# Altium schematic sheet Motor.SchDoc
size A; SheetNumber: 3; SheetTotal: 4
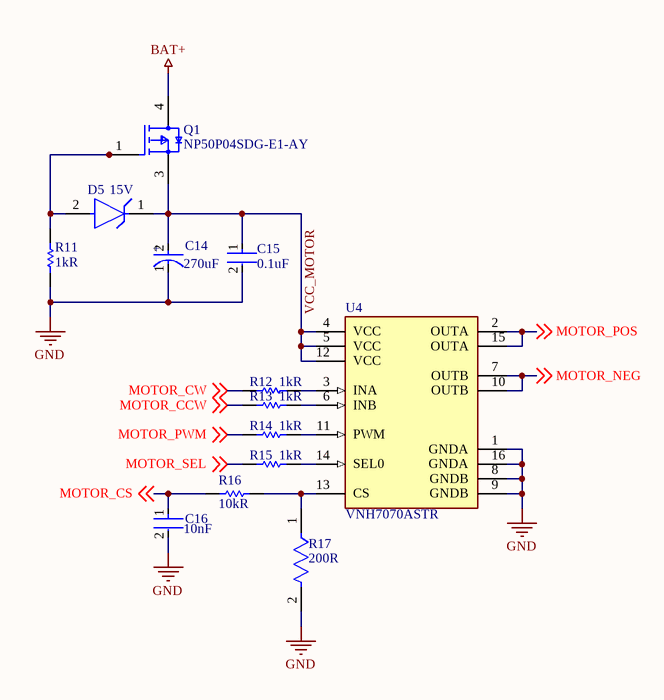
[diagram p0: Motor.SchDoc]

## Parts
C14  Capacitance: 270uF  [FP-EEH-G-MFG]  (hidden comment: EEHZT1V271P)
C15  Capacitance: 0.1uF  [FP-GCD21B-0_15-IPC_B]  (hidden comment: GCD21BR71H104MA01L)
C16  Capacitance: 10nF  [FP-C0805C103K8RACAUTO-MFG]  (hidden comment: C0805C103K8RACAUTO)
D5  Nom Zener Voltage: 15V  [FP-SOD123-MFG]  (hidden comment: MMSZ5245B-7-F)
Q1  NP50P04SDG-E1-AY  [DPAK230P1010X240-3_PRSS0004ZV-A_N]
R11  Resistance: 1kR  [RESC2013X60X35LL10T20]  (hidden comment: AC0805JR-071KL)
R12  Resistance: 1kR  [RESC2013X60X35LL10T20]  (hidden comment: AC0805JR-071KL)
R13  Resistance: 1kR  [RESC2013X60X35LL10T20]  (hidden comment: AC0805JR-071KL)
R14  Resistance: 1kR  [RESC2013X60X35LL10T20]  (hidden comment: AC0805JR-071KL)
R15  Resistance: 1kR  [RESC2013X60X35LL10T20]  (hidden comment: AC0805JR-071KL)
R16  value 10kR  [RESC2013X60X35NL10T20]  (hidden comment: RC0805FR-0710KL)
R17  Resistance: 200R  [FP-CRCW0805-HPe3-IPC_B]  (hidden comment: CRCW0805200RFKEAHP)
U4  VNH7070ASTR  [FP-SO-16N-GAPGCFT00818-MFG]

## Nets
BAT+: Q1.4(DRAIN)
GND: C14.1(C) C15.2 C16.2 R11.1 R17.2 U4.1(GNDA) U4.8(GNDB) U4.9(GNDB) U4.16(GNDA)
MOTOR_CCW: R13.1 ; off-sheet MOTOR_CCW
MOTOR_CS: C16.1 R16.1 ; off-sheet MOTOR_CS
MOTOR_CW: R12.1 ; off-sheet MOTOR_CW
MOTOR_NEG: U4.7(OUTB) U4.10(OUTB) ; off-sheet MOTOR_NEG
MOTOR_POS: U4.2(OUTA) U4.15(OUTA) ; off-sheet MOTOR_POS
MOTOR_PWM: R14.1 ; off-sheet MOTOR_PWM
MOTOR_SEL: R15.1 ; off-sheet MOTOR_SEL
VCC_MOTOR: C14.2(A) C15.1 D5.1(C) Q1.3(SOURCE) U4.4(VCC) U4.5(VCC) U4.12(VCC)
NetD5_2: D5.2(A) Q1.1(GATE) R11.2
NetR12_2: R12.2 U4.3(INA)
NetR13_2: R13.2 U4.6(INB)
NetR14_2: R14.2 U4.11(PWM)
NetR15_2: R15.2 U4.14(SEL0)
NetR16_2: R16.2 R17.1 U4.13(CS)

## Notes on the sheet
- (in symbol CMP-05428-001040-1) +

## Library data of the parts
C14 = CMP-05428-001040-1: Conductive Polymer Hybrid Aluminum Electrolytic Capacitors 270uF ±20% 35V RADIAL SMT 10x10.2mm; RoHS Compliant: Yes
C15 = CMP-06035-004518-1: Chip Multilayer Ceramic Capacitors for Automotive, 0805, 0.10uF, X7R, 15%, 20%, 50V, Grade 1
C16 = CMP-00212-126448506-1: C0805C103K8RACAUTO Cap, 0.01UF, 10V, Mlcc, 0805 Rohs Compliant: Yes; Material: Ceramic; Dielectric: X7R; Tolerance: 10%; Height: 880µm; NexarPartId: 126448506; Voltage Rating: 10V; Voltage Rating (DC): 10V; Min Operating Temperature: -55°C; Max Operating Temperature: 125°C; Case/Package: 0805; RoHS: Compliant
D5 = CMP-12792-000001-1: DIODE ZENER 15V 500MW SOD123; Manufacturer: Diodes Inc.; Power Dissipation: 370mW; Max Zener Voltage: 15.75V; Max Junction Temp: +150°C; Zener Impedance: 16Ω; Standoff Height: 0mm; Reverse Voltage: 11V; Max Reverse Leakage Current: 0.1uA; Device Class L3: Zener Diodes; Device Class L2: Diodes; Automotive: No; Device Class L1: Discrete Semiconductors; ComponentLink2URL: https://www.diodes.com/assets/Datasheets/ds18010.pdf; Package: SOD123; ComponentLink2Description: Datasheet; Digikey Description: DIODE ZENER 15V 500MW SOD123; RoHS: TRUE; Temperature: -65°C to +150°C; Octopart: https://octopart.com/mmsz5245b-7-f-diodes+inc.-332054; Mouser Description: Zener Diodes 15V 500mW; Height: 1.45mm; Temperature Range Low: -65°C; Lead Free: Yes; Manufacturer Part Number: MMSZ5245B-7-F; Footprint Url: https://www.diodes.com/assets/Package-Files/SOD123.pdf; Category: Diode; Temperature Range High: +150°C
Q1 = CMP-00572-18642745-1: Mosfet, P -Ch, 40V, 50A, To-252 Rohs Compliant: Yes; Manufacturer Lifecycle Status: ACTIVE; Drain to Source Voltage (Vdss): -40V; Rds On Max: 9.6mΩ; Fall Time: 180ns; Continuous Drain Current (ID): -50A; Turn-On Delay Time: 13ns; Gate to Source Voltage (Vgs): -20V; Max Power Dissipation: 1.2W; Max Junction Temperature (Tj): 175°C; Turn-Off Delay Time: 405ns; Input Capacitance: 5nF; Number of Elements: 1; Number of Pins: 3; Part Family: NP50P04SDG; Harmonized Tariff Schedule (HTS) Code: 8541.21.0095; HelpURL: https://octopart.com/cad-content/api/get-model-datasheet/15189/18642745; ComponentLink2URL: https://octopart.com/cad-content/api/get-model-datasheet/15189/18642745; Max Operating Temperature: 175°C; Length: 6mm; Height: 2.4mm; Radiation Hardening: No; Lifecycle Status: Production; Mount: Surface Mount; ComponentLink2Description: Datasheet URL; ComponentLink1Description: Manufacturer's Website; ComponentLink3Description: Manufacturer's Package Drawing; Lead Free: Lead Free; RoHS: Compliant; Case/Package: TO-252; ComponentLink3URL: https://www.renesas.com/en/document/psc/package-drawing-mp-3zk-3pin-prss0004zv; Drain to Source Resistance: 9.6MΩ; ComponentLink1URL: http://www.renesas.com; China RoHS: Compliant; MSL: 1; Export Control Classification Number (ECCN) Code: EAR99; Power Dissipation: 1.2W; Min Operating Temperature: -55°C; Rise Time: 13ns; Width: 6mm
R11-R15 = CMP-2001-04511-1: Manufacturer: Yageo; Part Number: AC0805JR-071KL
R16 = CMP-1659-00013-4: Chip Resistor, 10 KOhm, +/- 1%, 0.125 W, -55 to 155 degC, 0805 (2012 Metric), RoHS, Tape and Reel; Manufacturer: Yageo; Voltage Rating: 150 V; Power: 125mW; Rated Temperature: 70°C; Temperature Coefficient: 100ppm/°C; Additional Feature: LASER TRIMMABLE; Working Voltage: 150V; Package Length: 2mm; Package Height: 0.5mm; Package Width: 1.25mm; Mount: Surface Mount; ComponentLink1Description: Manufacturer URL; ComponentLink2URL: http://www.yageo.com/documents/recent/PYu-RC_Group_51_RoHS_L_04.pdf; Pins: 2; Length: 2 mm; Min Operating Temperature: -55 degC; Height: 0.5 mm; Mounting Technology: Surface Mount; RoHSCompliant: true; REACH SVHC: No SVHC; ComponentLink1URL: http://www.yageo.com/; Max Operating Temperature: 155 degC; PackageReference: 0805; DatasheetVersion: Rev. 4, 02/2016; Package Quantity: 5000; Packaging: Tape and Reel; ComponentLink2Description: Datasheet; PackageDescription: 2-Pin Surface Mounted Device, Body 2 x 1.25 mm; Supplier: Digikey; Supplier Part Number: 311-10.0KCRCT-ND; Manufacturer Part Number: RC0805FR-0710KL; RoHS: Yes; Category: Chip SMD Resistors; Stock: 4430741; Pricing: 1=0.1, 10=0.027, 50=0.017, 100=0.0142, 500=0.00976, 1000=0.00844 (USD); Package Shape: Rectangular; Terminal Finish: Nickel; Case/Package: 0805; Tolerance: 1%; JESD-609 Code: e3; Resistor Type: FIXED RESISTOR; Construction: Chip; Package Style: SMTMeter; Technology: METAL GLAZE/THICK FILM; Termination: Wraparound; Reach SVHC Compliant: Yes; RoHS Compliant: Yes; ComponentLink3URL: https://datasheet.ciiva.com:443/pdfs/VipMasterIC/IC/YAGO/YAGO-S-A0008145938/YAGO-S-A0008145938-1.pdf?src-supplier=IHS+Markit; ComponentLink3Description: https://datasheet.ciiva.com:443/pdfs/VipMasterIC/IC/YAGO/YAGO-S-A0008145938/YAGO-S-A0008145938-1.pdf?src-supplier=IHS+Markit; ComponentLink4URL: https://datasheet.ciiva.com/11808/0900766b8106beab-11808151.pdf?src-supplier=Rs; ComponentLink4Description: https://datasheet.ciiva.com/11808/0900766b8106beab-11808151.pdf?src-supplier=Rs; ComponentLink5URL: https://datasheet.ciiva.com/46447/444164-46447563.pdf?src-supplier=Element14; ComponentLink5Description: https://datasheet.ciiva.com/46447/444164-46447563.pdf?src-supplier=Element14; ComponentLink6URL: https://datasheet.ciiva.com/2456/pyu-r-int-thick-7-2456973.pdf?src-supplier=Digikey; ComponentLink6Description: https://datasheet.ciiva.com/2456/pyu-r-int-thick-7-2456973.pdf?src-supplier=Digikey; ComponentLink7URL: https://datasheet.ciiva.com/2456/pyu-r-int-thick-7-2456974.pdf?src-supplier=Digikey; ComponentLink7Description: https://datasheet.ciiva.com/2456/pyu-r-int-thick-7-2456974.pdf?src-supplier=Digikey; ComponentLink8URL: https://datasheet.ciiva.com/2456/pyu-r-int-thick-7-2456972.pdf?src-supplier=Digikey; ComponentLink8Description: https://datasheet.ciiva.com/2456/pyu-r-int-thick-7-2456972.pdf?src-supplier=Digikey; ComponentLink9URL: https://datasheet.ciiva.com/12669/rc0805-12669688.pdf?src-supplier=Mouser; ComponentLink9Description: https://datasheet.ciiva.com/12669/rc0805-12669688.pdf?src-supplier=Mouser; ComponentLink10URL: https://datasheet.ciiva.com/16747/rc0805-16747087.pdf?src-supplier=Future+Electronics; ComponentLink10Description: https://datasheet.ciiva.com/16747/rc0805-16747087.pdf?src-supplier=Future+Electronics
R17 = CMP-02407-008327-1: RES Thick Film, 200Ω, 1%, 0.5W, 100ppm/°C, 0805; Max Power Dissipation: 500mW; Min Operating Temperature: -55°C; Composition: Thick Film; Depth: 1.25mm; Max Operating Temperature: 155°C; Case/Package: 0805; Height: 0.024inch; Length: 2mm; Package Quantity: 5000; Military Standard: Not; Mount: Surface Mount; Contact Plating: Tin; Width: 0.049inch; Radiation Hardening: No; Packaging: Tape and Reel; Features: Automotive AEC-Q200; Number of Terminations: 2; Tolerance: 1%; Temperature Coefficient: 100ppm/°C; Lead Free: Lead Free
U4 = CMP-2000-07519-2: IC MOTOR DRIVER 4V-28V 16SOIC; Manufacturer: STMicroelectronics; Standoff Height: 0.1mm; Number Of Outputs: 2; Max Junction Temp: +150°C; Output Current: 15A; Max Supply Voltage: 28V; Automotive Grade: Grade 0; Motor Type: Brushed; Min Supply Voltage: 4V; Nominal Supply Current: 2-3.5mA; Digikey Description: IC MOTOR DRIVER 4V-28V 16SOIC; Device Class L1: Integrated Circuits (ICs); Ipc Land Pattern Name: SOIC127P600X175-16; Device Class L2: Power Management ICs; ComponentLink2Description: Datasheet; ComponentLink2URL: https://www.st.com/resource/en/datasheet/vnh7070as.pdf; Height: 1.75mm; RoHS: TRUE; Manufacturer Part Number: VNH7070ASTR; Octopart: https://octopart.com/vnh7070astr-stmicroelectronics-66668687; Temperature Range Low: -40°C; Mouser Description: STMicroelectronics VNH7070ASTR Motor Driver IC 16-Pin, SOIC; Device Class L3: Motor Drivers; Lead Free: Yes; Temperature: -40°C to +150°C; Automotive: Yes; Package: SO-16N-GAPGCFT00818; Temperature Range High: +150°C; Category: IC; Footprint Url: https://www.st.com/resource/en/datasheet/l6566a.pdf